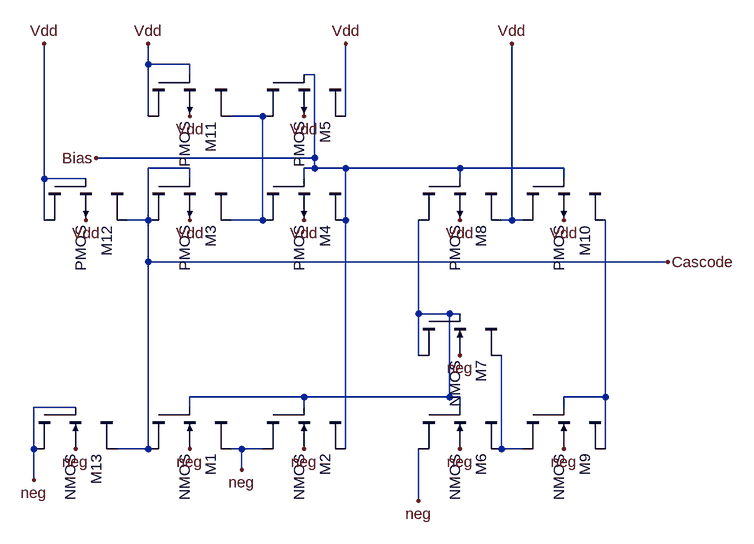
[diagram p0: schematic biasLVS.asc]
biasLVS.asc, the LTspice schematic file:
Version 4
SHEET 1 960 680
WIRE 32 -272 32 -304
WIRE 96 -272 32 -272
WIRE 96 -256 96 -272
WIRE 288 -256 272 -256
WIRE 32 -192 32 -272
WIRE 208 -192 160 -192
WIRE 336 -192 336 -304
WIRE 288 -128 288 -256
WIRE 288 -128 -48 -128
WIRE 96 -112 32 -112
WIRE 288 -112 288 -128
WIRE 288 -112 272 -112
WIRE 336 -112 288 -112
WIRE 512 -112 336 -112
WIRE 672 -112 512 -112
WIRE -128 -96 -128 -304
WIRE -64 -96 -128 -96
WIRE 96 -96 96 -112
WIRE 272 -96 272 -112
WIRE 512 -96 512 -112
WIRE 672 -96 672 -112
WIRE -128 -32 -128 -96
WIRE 32 -32 32 -112
WIRE 32 -32 0 -32
WIRE 208 -32 208 -192
WIRE 208 -32 160 -32
WIRE 336 -32 336 -112
WIRE 592 -32 592 -304
WIRE 592 -32 576 -32
WIRE 608 -32 592 -32
WIRE 32 32 32 -32
WIRE 832 32 32 32
WIRE 448 112 448 -32
WIRE 496 112 448 112
WIRE 512 112 496 112
WIRE 448 176 448 112
WIRE 272 240 96 240
WIRE 496 240 496 112
WIRE 496 240 272 240
WIRE 512 240 496 240
WIRE 736 240 736 -32
WIRE 736 240 672 240
WIRE -80 256 -144 256
WIRE 96 256 96 240
WIRE 272 256 272 240
WIRE 512 256 512 240
WIRE 672 256 672 240
WIRE -144 320 -144 256
WIRE 32 320 32 32
WIRE 32 320 -16 320
WIRE 176 320 160 320
WIRE 208 320 176 320
WIRE 336 320 336 -32
WIRE 576 320 576 176
WIRE 608 320 576 320
WIRE 736 320 736 240
WIRE 176 352 176 320
WIRE -144 368 -144 320
WIRE 448 400 448 320
FLAG 96 -32 Vdd
FLAG 272 -32 Vdd
FLAG 272 -192 Vdd
FLAG 336 -304 Vdd
FLAG 512 -32 Vdd
FLAG 672 -32 Vdd
FLAG 592 -304 Vdd
FLAG 832 32 Cascode
FLAG -48 -128 Bias
FLAG 96 -192 Vdd
FLAG 32 -304 Vdd
FLAG -128 -304 Vdd
FLAG -64 -32 Vdd
FLAG 672 320 neg
FLAG 512 320 neg
FLAG 448 400 neg
FLAG 272 320 neg
FLAG 176 352 neg
FLAG 96 320 neg
FLAG -80 320 neg
FLAG -144 368 neg
FLAG 512 176 neg
SYMBOL cktsym\\nmos4 96 320 R90
SYMATTR InstName M1
SYMATTR Value2 l=3.9u w=2.1u
SYMBOL cktsym\\nmos4 272 320 R90
SYMATTR InstName M2
SYMATTR Value2 l=8.1u w=.9u
SYMBOL cktsym\\pmos4 96 -32 R90
SYMATTR InstName M3
SYMATTR Value2 l=3.9u w=8.1u
SYMBOL cktsym\\pmos4 272 -32 R90
SYMATTR InstName M4
SYMATTR Value2 l=.9u w=8.1u
SYMBOL cktsym\\pmos4 272 -192 R90
SYMATTR InstName M5
SYMATTR Value2 l=3.9u w=8.1u
SYMBOL cktsym\\nmos4 512 320 R90
SYMATTR InstName M6
SYMATTR Value2 l=3.9u w=2.1u
SYMBOL cktsym\\nmos4 512 176 R90
SYMATTR InstName M7
SYMATTR Value2 l=3.9u w=8.1u
SYMBOL cktsym\\pmos4 512 -32 R90
SYMATTR InstName M8
SYMATTR Value2 l=3.9u w=1.8u
SYMBOL cktsym\\nmos4 672 320 R90
SYMATTR InstName M9
SYMATTR Value2 l=3.9u w=2.1u
SYMBOL cktsym\\pmos4 672 -32 R90
SYMATTR InstName M10
SYMATTR Value2 l=3.9u w=8.1u
SYMBOL cktsym\\pmos4 96 -192 R90
SYMATTR InstName M11
SYMATTR Value2 l=3.9u w=8.1u
SYMBOL cktsym\\pmos4 -64 -32 R90
SYMATTR InstName M12
SYMATTR Value2 l=3.9u w=8.1u
SYMBOL cktsym\\nmos4 -80 320 R90
SYMATTR InstName M13
SYMATTR Value2 l=3.9u w=2.1u

The netlist it stands for:
* biasLVS.asc
M1 neg N002 Cascode neg NMOS l=3.9u w=2.1u
M2 Bias N002 neg neg NMOS l=8.1u w=.9u
M3 Cascode Cascode N001 Vdd PMOS l=3.9u w=8.1u
M4 N001 Bias Bias Vdd PMOS l=.9u w=8.1u
M5 N001 Bias Vdd Vdd PMOS l=3.9u w=8.1u
M6 N004 N002 neg neg NMOS l=3.9u w=2.1u
M7 N004 N002 N002 neg NMOS l=3.9u w=8.1u
M8 N002 Bias Vdd Vdd PMOS l=3.9u w=1.8u
M9 N003 N003 N004 neg NMOS l=3.9u w=2.1u
M10 Vdd Bias N003 Vdd PMOS l=3.9u w=8.1u
M11 Vdd Vdd N001 Vdd PMOS l=3.9u w=8.1u
M12 Vdd Vdd Cascode Vdd PMOS l=3.9u w=8.1u
M13 Cascode neg neg neg NMOS l=3.9u w=2.1u
.model NMOS NMOS
.model PMOS PMOS
.lib standard.mos
.backanno
.end